# Altium schematic sheet STM32.SchDoc
size A3; SheetNumber: 11; SheetTotal: 14
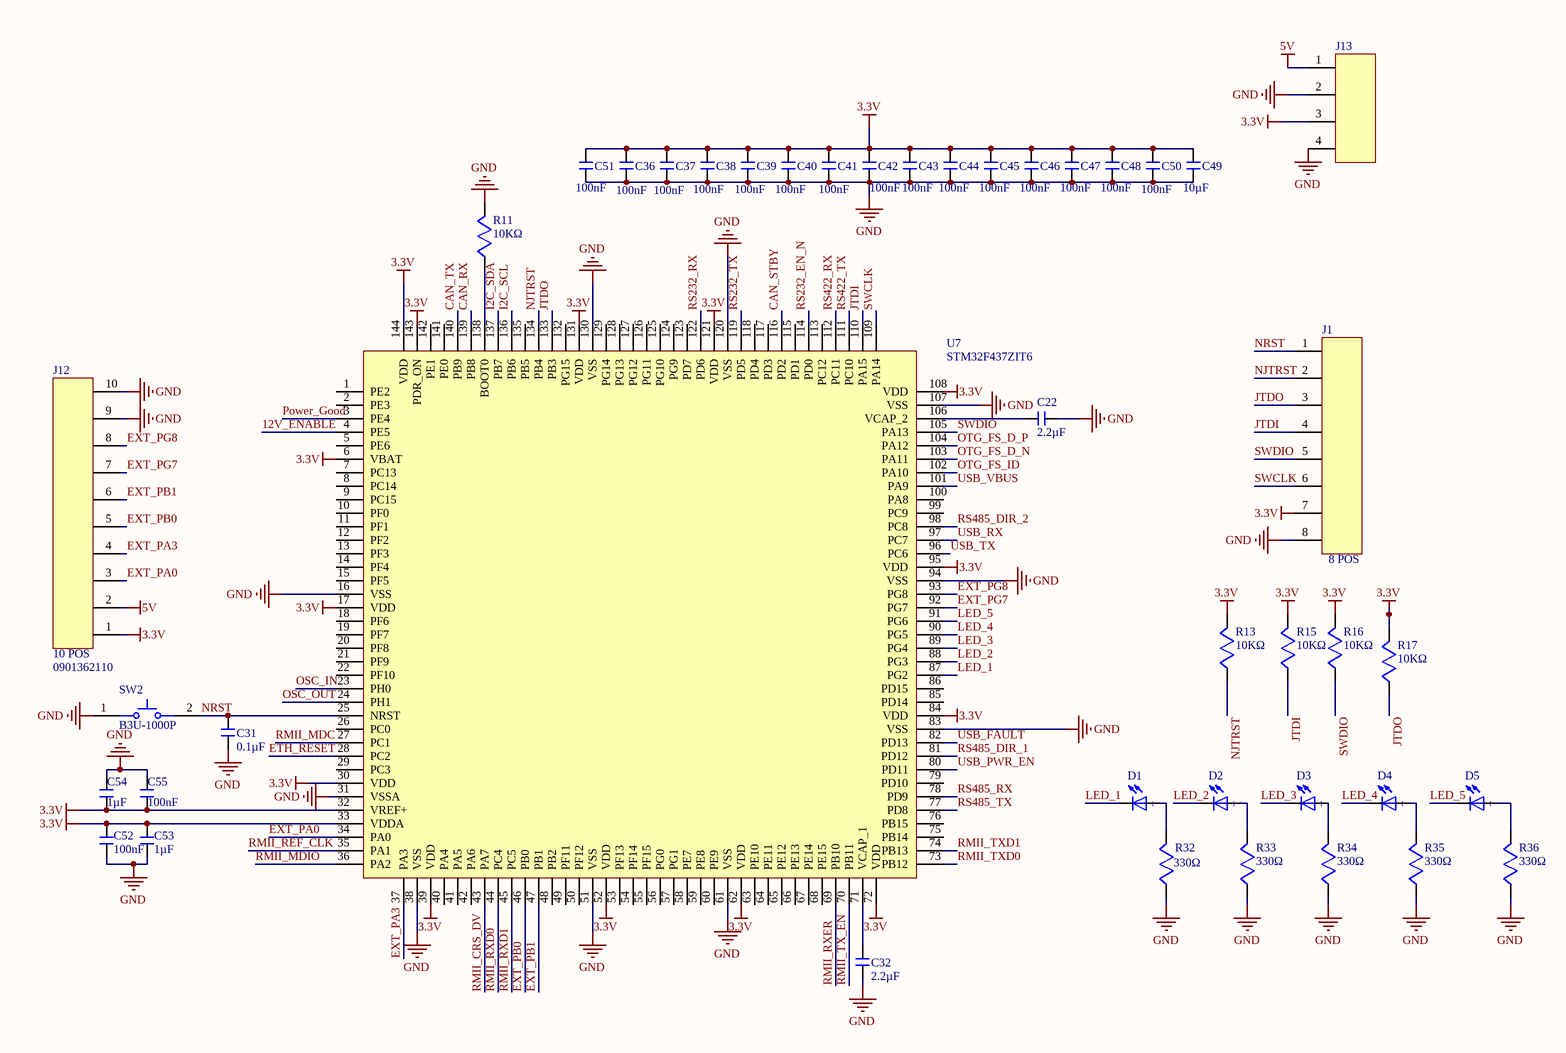
[diagram p0: STM32.SchDoc]

## Parts
C22  value 2.2µF  [402 capacitor - duplicate]  (hidden comment: 0402 capacitor)
C31  value 0.1µF  [402 capacitor - duplicate]  (hidden comment: 0402 capacitor)
C32  value 2.2µF  [402 capacitor - duplicate]  (hidden comment: 0402 capacitor)
C36  value 100nF  [402 capacitor - duplicate]  (hidden comment: 0402 capacitor)
C37  value 100nF  [402 capacitor - duplicate]  (hidden comment: 0402 capacitor)
C38  value 100nF  [402 capacitor - duplicate]  (hidden comment: 0402 capacitor)
C39  value 100nF  [402 capacitor - duplicate]  (hidden comment: 0402 capacitor)
C40  value 100nF  [402 capacitor - duplicate]  (hidden comment: 0402 capacitor)
C41  value 100nF  [402 capacitor - duplicate]  (hidden comment: 0402 capacitor)
C42  value 100nF  [402 capacitor - duplicate]  (hidden comment: 0402 capacitor)
C43  value 100nF  [402 capacitor - duplicate]  (hidden comment: 0402 capacitor)
C44  value 100nF  [402 capacitor - duplicate]  (hidden comment: 0402 capacitor)
C45  value 100nF  [402 capacitor - duplicate]  (hidden comment: 0402 capacitor)
C46  value 100nF  [402 capacitor - duplicate]  (hidden comment: 0402 capacitor)
C47  value 100nF  [402 capacitor - duplicate]  (hidden comment: 0402 capacitor)
C48  value 100nF  [402 capacitor - duplicate]  (hidden comment: 0402 capacitor)
C49  value 10µF  [603 CAPACITOR]  (hidden comment: 0603 CAPACİTOR)
C50  value 100nF  [402 capacitor - duplicate]  (hidden comment: 0402 capacitor)
C51  value 100nF  [402 capacitor - duplicate]  (hidden comment: 0402 capacitor)
C52  value 100nF  [402 capacitor - duplicate]  (hidden comment: 0402 capacitor)
C53  value 1µF  [402 capacitor - duplicate]  (hidden comment: 0402 capacitor)
C54  value 1µF  [402 capacitor - duplicate]  (hidden comment: 0402 capacitor)
C55  value 100nF  [402 capacitor - duplicate]  (hidden comment: 0402 capacitor)
D1  150060RS75000  [150080GS75000]  (value not drawn)
D2  150060RS75000  [150080GS75000]  (value not drawn)
D3  150060RS75000  [150080GS75000]  (value not drawn)
D4  150060RS75000  [150080GS75000]  (value not drawn)
D5  150060RS75000  [150080GS75000]  (value not drawn)
J1  8 POS  [0901362108]
J12  10 POS  [0901362110]
J13  61300411821  [61300411821]  (value not drawn)
R11  value 10KΩ  [402 RESISTOR]  (hidden comment: 0402. RESİSTOR)
R13  value 10KΩ  [402 RESISTOR]  (hidden comment: 0402. RESİSTOR)
R15  value 10KΩ  [402 RESISTOR]  (hidden comment: 0402. RESİSTOR)
R16  value 10KΩ  [402 RESISTOR]  (hidden comment: 0402. RESİSTOR)
R17  value 10KΩ  [402 RESISTOR]  (hidden comment: 0402. RESİSTOR)
R32  value 330Ω  [402 RESISTOR]  (hidden comment: 0402. RESİSTOR)
R33  value 330Ω  [402 RESISTOR]  (hidden comment: 0402. RESİSTOR)
R34  value 330Ω  [402 RESISTOR]  (hidden comment: 0402. RESİSTOR)
R35  value 330Ω  [402 RESISTOR]  (hidden comment: 0402. RESİSTOR)
R36  value 330Ω  [402 RESISTOR]  (hidden comment: 0402. RESİSTOR)
SW2  B3U-1000P  [OMRON-B3U-1000_V]
U7  STM32F437ZIT6  [STM32F437ZIT6]

## Nets
3.3V: C36.1 C37.1 C38.1 C39.1 C40.1 C41.1 C42.1 C43.1 C44.1 C45.1 C46.1 C47.1 C48.1 C49.2 C50.1 C51.1 C52.2 C53.2 C54.2 C55.2 J1.7 J12.1 J13.3 R13.2 R15.2 R16.2 R17.2 U7.6(VBAT) U7.17(VDD) U7.30(VDD) U7.32(VREF+) U7.33(VDDA) U7.39(VDD) U7.52(VDD) U7.62(VDD) U7.72(VDD) U7.84(VDD) U7.95(VDD) U7.108(VDD) U7.121(VDD) U7.131(VDD) U7.143(PDR_ON) U7.144(VDD)
5V: J12.2 J13.1
GND: C22.2 C31.1 C32.1 C36.2 C37.2 C38.2 C39.2 C40.2 C41.2 C42.2 C43.2 C44.2 C45.2 C46.2 C47.2 C48.2 C49.1 C50.2 C51.2 C52.1 C53.1 C54.1 C55.1 J1.8 J12.9 J12.10 J13.2 J13.4 R11.2 R32.1 R33.1 R34.1 R35.1 R36.1 SW2.1 U7.16(VSS) U7.31(VSSA) U7.38(VSS) U7.51(VSS) U7.61(VSS) U7.83(VSS) U7.94(VSS) U7.107(VSS) U7.120(VSS) U7.130(VSS)
12V_ENABLE: U7.4(PE5)
CAN_RX: U7.139(PB8)
CAN_STBY: U7.116(PD2)
CAN_TX: U7.140(PB9)
ETH_RESET: U7.28(PC2)
EXT_PA0: J12.3 U7.34(PA0)
EXT_PA3: J12.4 U7.37(PA3)
EXT_PB0: J12.5 U7.46(PB0)
EXT_PB1: J12.6 U7.47(PB1)
EXT_PG7: J12.7 U7.92(PG7)
EXT_PG8: J12.8 U7.93(PG8)
I2C_SCL: U7.136(PB6)
I2C_SDA: U7.137(PB7)
JTDI: J1.4 R15.1 U7.110(PA15)
JTDO: J1.3 R17.1 U7.133(PB3)
LED_1: D1.1(NEG) U7.87(PG2)
LED_2: D2.1(NEG) U7.88(PG3)
LED_3: D3.1(NEG) U7.89(PG4)
LED_4: D4.1(NEG) U7.90(PG5)
LED_5: D5.1(NEG) U7.91(PG6)
NJTRST: J1.2 R13.1 U7.134(PB4)
NRST: C31.2 J1.1 SW2.2 U7.25(NRST)
OSC_IN: U7.23(PH0)
OSC_OUT: U7.24(PH1)
OTG_FS_D_N: U7.103(PA11)
OTG_FS_D_P: U7.104(PA12)
OTG_FS_ID: U7.102(PA10)
Power_Good: U7.3(PE4)
RMII_CRS_DV: U7.43(PA7)
RMII_MDC: U7.27(PC1)
RMII_MDIO: U7.36(PA2)
RMII_REF_CLK: U7.35(PA1)
RMII_RXD0: U7.44(PC4)
RMII_RXD1: U7.45(PC5)
RMII_RXER: U7.69(PB10)
RMII_TX_EN: U7.70(PB11)
RMII_TXD0: U7.73(PB12)
RMII_TXD1: U7.74(PB13)
RS232_EN_N: U7.114(PD0)
RS232_RX: U7.122(PD6)
RS232_TX: U7.119(PD5)
RS422_RX: U7.112(PC11)
RS422_TX: U7.111(PC10)
RS485_DIR_1: U7.81(PD12)
RS485_DIR_2: U7.98(PC8)
RS485_RX: U7.78(PD9)
RS485_TX: U7.77(PD8)
SWCLK: J1.6 U7.109(PA14)
SWDIO: J1.5 R16.1 U7.105(PA13)
USB_FAULT: U7.82(PD13)
USB_PWR_EN: U7.80(PD11)
USB_RX: U7.97(PC7)
USB_TX: U7.96(PC6)
USB_VBUS: U7.101(PA9)
NetC22_1: C22.1 U7.106(VCAP_2)
NetC32_2: C32.2 U7.71(VCAP_1)
NetD1_2: D1.2(POS) R32.2
NetD2_2: D2.2(POS) R33.2
NetD3_2: D3.2(POS) R34.2
NetD4_2: D4.2(POS) R35.2
NetD5_2: D5.2(POS) R36.2
NetR11_1: R11.1 U7.138(BOOT0)

Not connected (* = marked no-connect by the designer): U7 1(PE2_) 2(PE3) 5(PE6) 7(PC13) 8(PC14) 9(PC15) 10(PF0) 11(PF1) 12(PF2) 13(PF3) 14(PF4) 15(PF5) 18(PF6) 19(PF7) 20(PF8) 21(PF9) 22(PF10) 26(PC0) 29(PC3) 40(PA4) 41(PA5) 42(PA6) 48(PB2) 49(PF11) 50(PF12) 53(PF13) 54(PF14) 55(PF15) 56(PG0) 57(PG1) 58(PE7) 59(PE8) 60(PE9) 63(PE10) 64(PE11) 65(PE12) 66(PE13) 67(PE14) 68(PE15) 75(PB14) 76(PB15) 79(PD10) 85(PD14) 86(PD15) 99(PC9) 100(PA8) 113(PC12) 115(PD1) 117(PD3) 118(PD4) 123(PD7) 124(PG9) 125(PG10) 126(PG11) 127(PG12) 128(PG13) 129(PG14) 132(PG15) 135(PB5) 141(PE0) 142(PE1)

## Notes on the sheet
- (in symbol 150060RS75000) +

## Library data of the parts
C22 C32 = CAP SMD 402: MPN: C1005X5R1V225K050BC; Package: 0402
C31 C36-C48 C50-C52 C55 = CAP SMD 402: MPN: CL05A104KA5NNNC; Package: 0402
C49 = CAP SMD 0603: MPN: GRM188R61E106MA73D; Pacage: 0603
C53 C54 = CAP SMD 402: MPN: GRM155R6YA105KE11D; Package: 0402
D1-D5 = 150060RS75000: LED RED CLEAR 0603 SMD; MPN: 150060RS75000
J1 = 0901362108: CONN HEADER R/A 8POS 2.54MM; MPN: 0901362108
J12 = 0901362110: CONN HEADER R/A 10POS 2.54MM; MPN: 0901362110
J13 = 61300411821: WR-PHD 2.54 MM SOCKET HEADER 4 P; MPN: 61300411821
R11 R13 R15-R17 = RES SMD 0402: MPN: RNCF0402BTE10K0; Package: 0402
R32-R36 = RES SMD 0402: MPN: RC0402FR-13300RL; Package: 0402
SW2 = CMP-011-00000-2: Tactile Switch, SPST-NO, 0.05 A, 12 V, -25 to 70 degC, 2-Pin SMD, RoHS, Tape and Reel; MPN: B3U-1000P
U7 = STM32F437ZIT6: MCU 32-bit STM32F ARM Cortex M4 RISC 2048KB Flash 2.5V/3.3V 144-Pin LQFP Tray (0V - 3.3V, 25Ω - 40kΩ); Manufacturer: STMicroelectronics; ADC Channels (Resolution): 24-Ch 12-Bit; Core Architecture: ARM Cortex-M4; DAC Channels (Resolution): 2-Ch 12-Bit; Data Bus Width: 32b; EEPROM Memory Size: 0B; Flash Memory Size: 2MB; Frequency: 180MHz; Interface: Ethernet, IrDA, LIN, USB; Max Supply Current: 125mA; Max Supply Voltage: 3.6V; Min Supply Voltage: 1.7V; Nominal Supply Current: 1.7µA; Number of A/D Converters: 3; Number of Channels: 24; Number of D/A Converters: 2; Number of I/Os: 114; Number of SPI Channels: 6; Number of UART Channels: 4; Oscillator Type: Internal; Peripherals: POR; RAM Size: 256kB; Watchdog Timer: Yes; Supplier: Farnell; Supplier Part Number: STM32F437ZIT6; Manufacturer Part Number: STM32F437ZIT6; RoHS: Compliant; Category: Microcontrollers; Pricing: 1=17,03, 10=13,98, 100=12,67, 250=11,67, 500=10,73, 1000=9,86, 2000=9,23 (EUR); Case/Package: LFQFP; China RoHS: Compliant; Country of Origin: Mainland China, Malaysia, Taiwan; Export Control Classification Number (ECCN) Code: 5A992.C; Height - Seated (Max): 1.6mm; Harmonized Tariff Schedule (HTS) Code: 8542.31.00.25; Introduction Date: 2013-02-13; Lead Free: Lead Free; Length: 20mm; Lifecycle Status: Production; Clock Frequency: 180MHz; Max Operating Temperature: 85°C; Memory Size: 2MB; Memory Format: FLASH; Min Operating Temperature: -40°C; Nominal Supply Voltage (DC): 3.3V; Number of I2C Channels: 3; Pins: 144; Number of Programmable I/O: 114; Number of Terminals: 144; Number of Timers/Counters: 2; Number of USART Channels: 4; Packaging: Bulk; Radiation Hardening: No; REACH SVHC: Yes; Schedule B: 8542310000, 8542310000|8542310000|8542310000|8542310000|8542310000; Temperature Grade: Industrial; Terminal Pitch: 500µm; Width: 20mm; ComponentLink1URL: https://datasheet.octopart.com:443/STM32F437ZIT6-STMicroelectronics-datasheet-181247468.pdf?src-supplier=IHS; ComponentLink1Description: https://datasheet.octopart.com:443/STM32F437ZIT6-STMicroelectronics-datasheet-181247468.pdf?src-supplier=IHS; ComponentLink2URL: https://datasheet.octopart.com:443/STM32F437ZIT6-STMicroelectronics-datasheet-109682747.pdf?src-supplier=ODG+(Origin+Data+Global); ComponentLink2Description: https://datasheet.octopart.com:443/STM32F437ZIT6-STMicroelectronics-datasheet-109682747.pdf?src-supplier=ODG+(Origin+Data+Global); ComponentLink3URL: https://datasheet.octopart.com:443/STM32F437ZIT6-STMicroelectronics-datasheet-27203479.pdf?src-supplier=Upverter; ComponentLink3Description: https://datasheet.octopart.com:443/STM32F437ZIT6-STMicroelectronics-datasheet-27203479.pdf?src-supplier=Upverter; ComponentLink4URL: https://datasheet.octopart.com:443/STM32F437ZIT6-STMicroelectronics-datasheet-16349512.pdf?src-supplier=Future+Electronics; ComponentLink4Description: https://datasheet.octopart.com:443/STM32F437ZIT6-STMicroelectronics-datasheet-16349512.pdf?src-supplier=Future+Electronics; ComponentLink5URL: https://datasheet.octopart.com:443/STM32F437ZIT6-STMicroelectronics-datasheet-62069530.pdf?src-supplier=STMicroelectronics; ComponentLink5Description: https://datasheet.octopart.com:443/STM32F437ZIT6-STMicroelectronics-datasheet-62069530.pdf?src-supplier=STMicroelectronics; ComponentLink6URL: https://datasheet.octopart.com:443/STM32F437ZIT6-STMicroelectronics-datasheet-34148158.pdf?src-supplier=STMicroelectronics; ComponentLink6Description: https://datasheet.octopart.com:443/STM32F437ZIT6-STMicroelectronics-datasheet-34148158.pdf?src-supplier=STMicroelectronics; ComponentLink7URL: https://datasheet.octopart.com:443/STM32F437ZIT6-STMicroelectronics-datasheet-66001099.pdf?src-supplier=HQonline; ComponentLink7Description: https://datasheet.octopart.com:443/STM32F437ZIT6-STMicroelectronics-datasheet-66001099.pdf?src-supplier=HQonline; ComponentLink8URL: https://datasheet.octopart.com:443/STM32F437ZIT6-STMicroelectronics-datasheet-38329676.pdf?src-supplier=Newark; ComponentLink8Description: https://datasheet.octopart.com:443/STM32F437ZIT6-STMicroelectronics-datasheet-38329676.pdf?src-supplier=Newark; ComponentLink9URL: https://datasheet.octopart.com:443/STM32F437ZIT6-STMicroelectronics-datasheet-21407670.pdf?src-supplier=Farnell; ComponentLink9Description: https://datasheet.octopart.com:443/STM32F437ZIT6-STMicroelectronics-datasheet-21407670.pdf?src-supplier=Farnell; ComponentLink10URL: https://datasheet.octopart.com:443/STM32F437ZIT6-STMicroelectronics-datasheet-16809516.pdf?src-supplier=Farnell; ComponentLink10Description: https://datasheet.octopart.com:443/STM32F437ZIT6-STMicroelectronics-datasheet-16809516.pdf?src-supplier=Farnell; ComponentLink11URL: https://datasheet.octopart.com:443/STM32F437ZIT6-STMicroelectronics-datasheet-62046042.pdf?src-supplier=element14+APAC; ComponentLink11Description: https://datasheet.octopart.com:443/STM32F437ZIT6-STMicroelectronics-datasheet-62046042.pdf?src-supplier=element14+APAC; MPN: STM32F437ZIT6